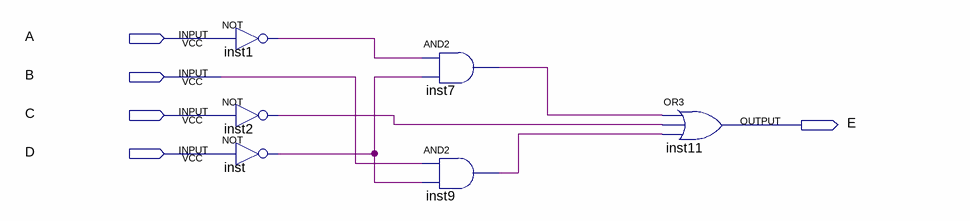
[diagram p0: schematic sheet]
// Quartus schematic Halfadd.bdf as structural Verilog: 6 symbols, 5 pins
module Halfadd (
  input  A,
  input  B,
  input  C,
  input  D,
  output E
);

  wire inst1_out, inst2_out, inst7_out, inst9_out, inst_out;

  not inst1 (inst1_out, A);
  not inst2 (inst2_out, C);
  not inst (inst_out, D);
  and inst7 (inst7_out, inst1_out, inst_out);
  and inst9 (inst9_out, B, inst_out);
  or inst11 (E, inst7_out, inst2_out, inst9_out);
endmodule
